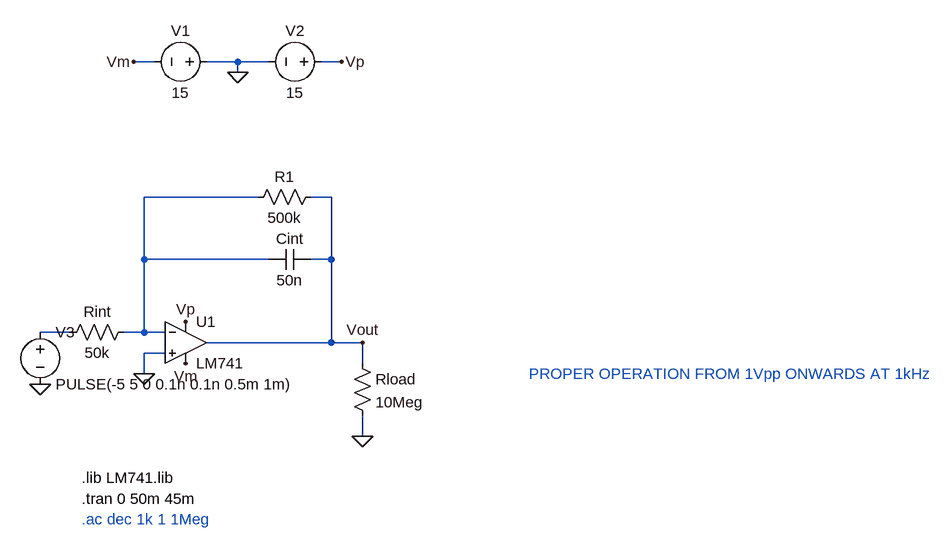
[diagram p0: schematic Integrator.asc]
Integrator.asc, the LTspice schematic file:
Version 4
SHEET 1 1540 1232
WIRE 144 448 112 448
WIRE 272 448 224 448
WIRE 320 448 272 448
WIRE 432 448 400 448
WIRE 272 464 272 448
WIRE 304 656 128 656
WIRE 416 656 384 656
WIRE 128 752 128 656
WIRE 320 752 128 752
WIRE 416 752 416 656
WIRE 416 752 384 752
WIRE 16 864 -32 864
WIRE 128 864 128 752
WIRE 128 864 96 864
WIRE 160 864 128 864
WIRE 416 880 416 752
WIRE 416 880 224 880
WIRE 464 880 416 880
WIRE 160 896 128 896
WIRE 464 912 464 880
WIRE 128 928 128 896
WIRE 464 1024 464 992
FLAG 272 464 0
FLAG 112 448 Vm
FLAG 432 448 Vp
FLAG 192 848 Vp
FLAG 192 912 Vm
FLAG 128 928 0
FLAG 464 1024 0
FLAG 464 880 Vout
FLAG -32 944 0
SYMBOL voltage 240 448 R90
WINDOW 0 -32 56 VBottom 2
WINDOW 3 32 56 VTop 2
WINDOW 123 0 0 Left 0
WINDOW 39 0 0 Left 0
SYMATTR InstName V1
SYMATTR Value 15
SYMBOL voltage 416 448 R90
WINDOW 0 -32 56 VBottom 2
WINDOW 3 32 56 VTop 2
WINDOW 123 0 0 Left 0
WINDOW 39 0 0 Left 0
SYMATTR InstName V2
SYMATTR Value 15
SYMBOL OpAmps\\opamp2 192 816 R0
SYMATTR InstName U1
SYMATTR Value LM741
SYMBOL res 112 848 R90
WINDOW 0 0 56 VBottom 2
WINDOW 3 32 56 VTop 2
SYMATTR InstName Rint
SYMATTR Value 50k
SYMBOL cap 384 736 R90
WINDOW 0 0 32 VBottom 2
WINDOW 3 32 32 VTop 2
SYMATTR InstName Cint
SYMATTR Value 50n
SYMBOL res 448 896 R0
SYMATTR InstName Rload
SYMATTR Value 10Meg
SYMBOL res 400 640 R90
WINDOW 0 0 56 VBottom 2
WINDOW 3 32 56 VTop 2
SYMATTR InstName R1
SYMATTR Value 500k
SYMBOL voltage -32 848 R0
WINDOW 123 0 0 Left 0
WINDOW 39 0 0 Left 0
SYMATTR InstName V3
SYMATTR Value PULSE(-5 5 0 0.1n 0.1n 0.5m 1m)
TEXT 32 1088 Left 2 !.lib LM741.lib
TEXT 32 1120 Left 2 !.tran 0 50m 45m
TEXT 32 1152 Left 2 ;.ac dec 1k 1 1Meg
TEXT 720 928 Left 2 ;PROPER OPERATION FROM 1Vpp ONWARDS AT 1kHz

The netlist it stands for:
* Integrator.asc
V1 0 Vm 15
V2 Vp 0 15
XU1 0 N001 Vp Vm Vout LM741  ; pins In+ In- V+ V- OUT
Rint N001 N002 50k
Cint Vout N001 50n
Rload Vout 0 10Meg
R1 Vout N001 500k
V3 N002 0 PULSE(-5 5 0 0.1n 0.1n 0.5m 1m)
.lib LM741.lib
.tran 0 50m 45m
* .ac dec 1k 1 1Meg
* PROPER OPERATION FROM 1Vpp ONWARDS AT 1kHz
.backanno
.end